# EAGLE design statuum (EAGLE 7.7.0)
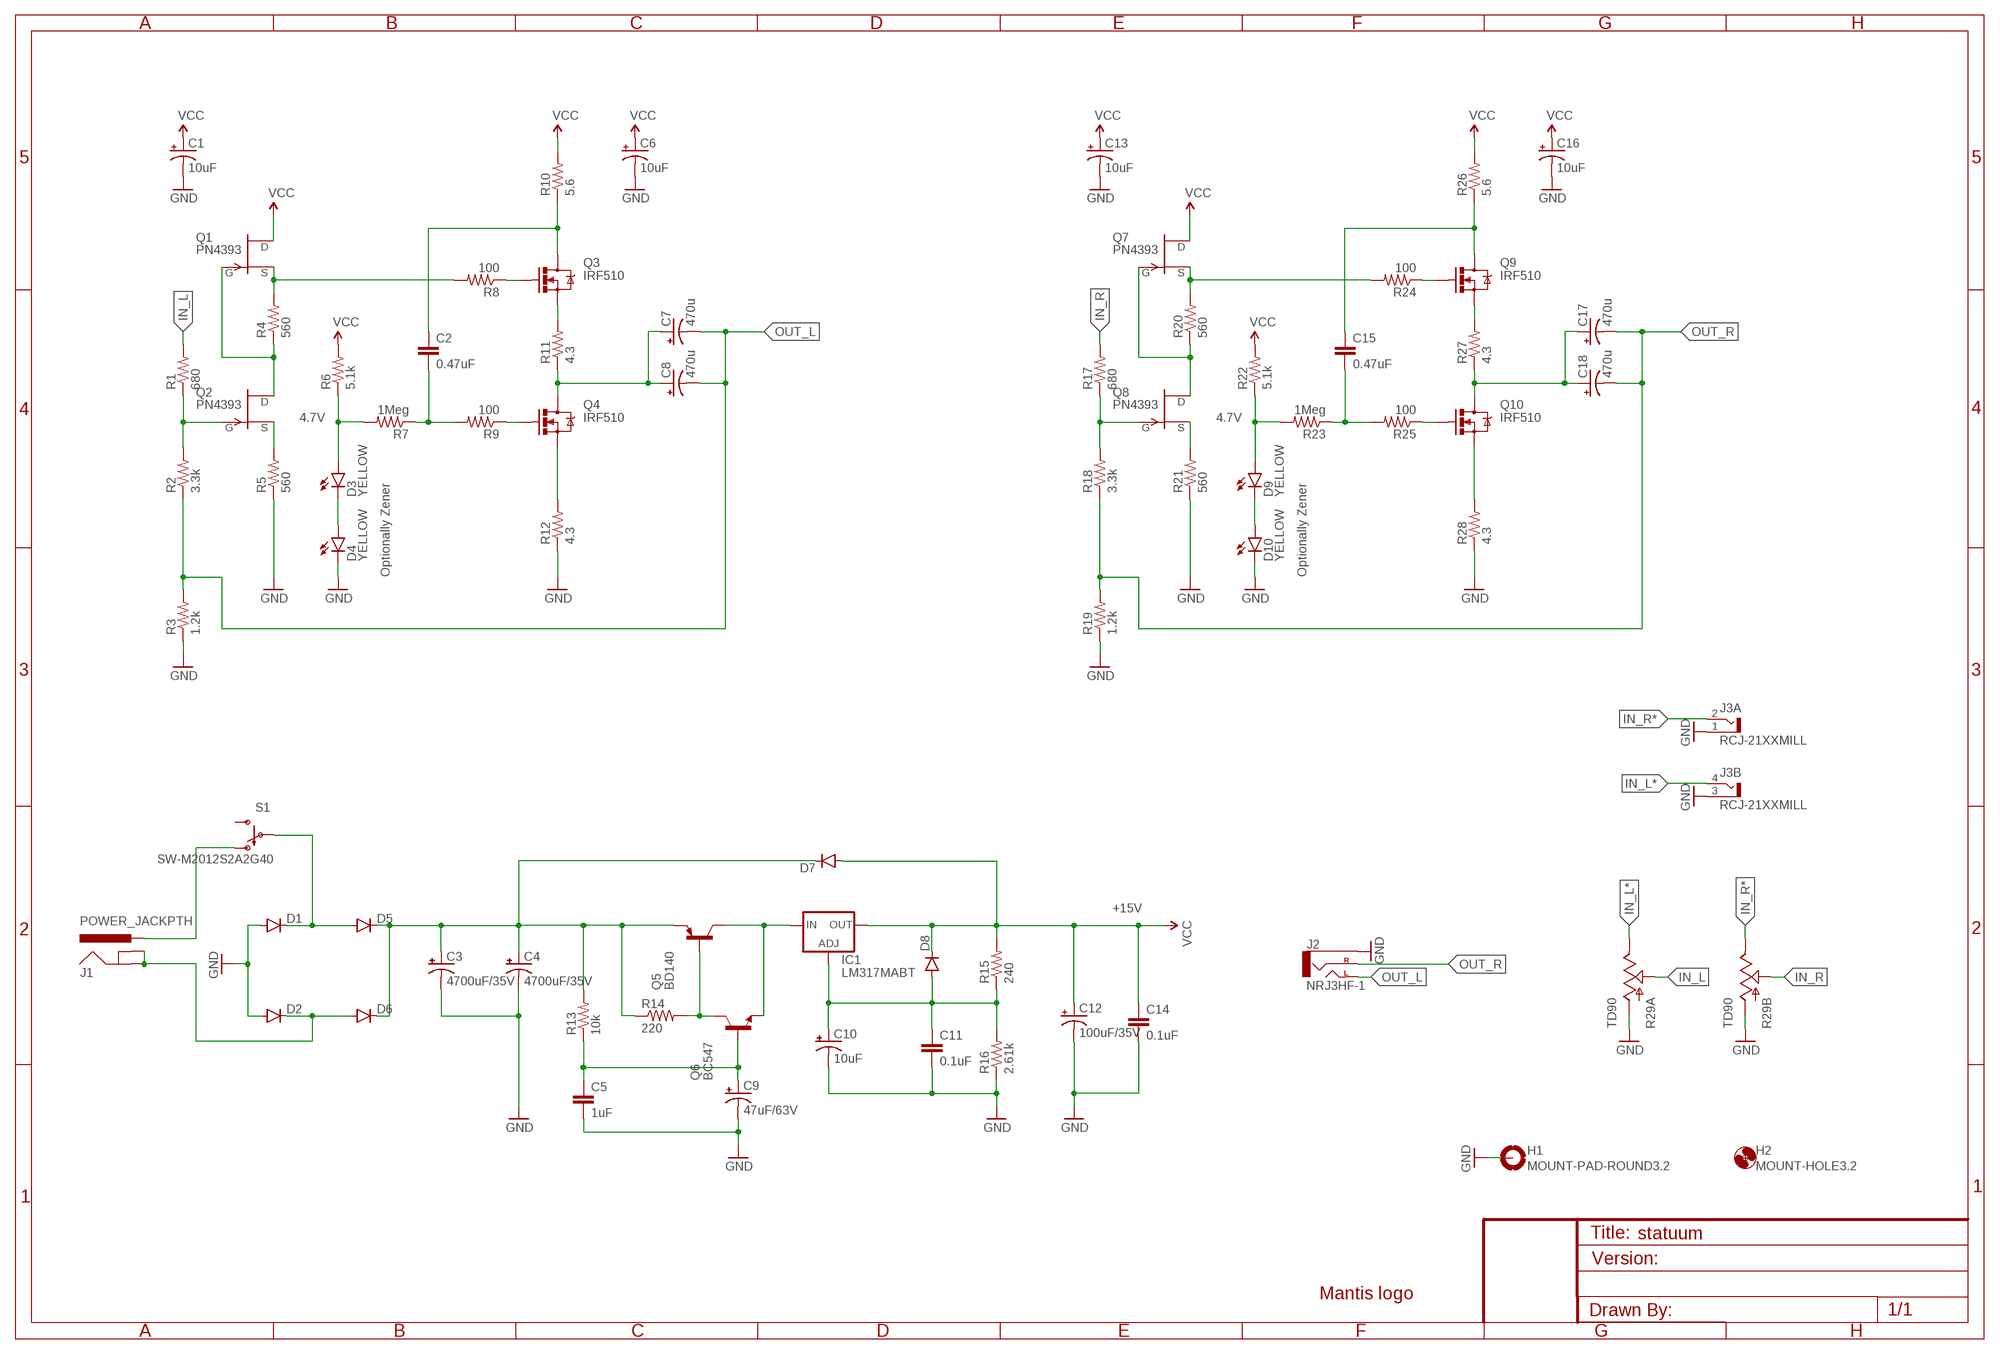
[diagram p0: schematic, sheet 1]

## Parts
C1  10uF  CAP_POLPTH-5/2.5-SM  [CPOL-RADIAL-5/2.5-SM]
C2  0.47uF  C5/3.5  [C5B3.5]
C3  4700uF/35V  CAP_POLPTH-16/7.5  [CPOL-RADIAL-16/7.5]
C4  4700uF/35V  CAP_POLPTH-16/7.5  [CPOL-RADIAL-16/7.5]
C5  1uF  CAPPTH  [CAP-PTH-SMALL]
C6  10uF  CAP_POLPTH-5/2.5-SM  [CPOL-RADIAL-5/2.5-SM]
C7  470u  CAP_POLPTH-8/3.5  [CPOL-RADIAL-8/3.5]
C8  470u  CAP_POLPTH-8/3.5  [CPOL-RADIAL-8/3.5]
C9  47uF/63V  CAP_POLPTH-6.5/2.5  [CPOL-RADIAL-6.5/2.5]
C10  10uF  CAP_POLPTH-5/2.5-SM  [CPOL-RADIAL-5/2.5-SM]
C11  0.1uF  CAPPTH  [CAP-PTH-SMALL]
C12  100uF/35V  CAP_POLPTH-8/3.5  [CPOL-RADIAL-8/3.5]
C13  10uF  CAP_POLPTH-5/2.5-SM  [CPOL-RADIAL-5/2.5-SM]
C14  0.1uF  CAPPTH  [CAP-PTH-SMALL]
C15  0.47uF  C5/3.5  [C5B3.5]
C16  10uF  CAP_POLPTH-5/2.5-SM  [CPOL-RADIAL-5/2.5-SM]
C17  470u  CAP_POLPTH-8/3.5  [CPOL-RADIAL-8/3.5]
C18  470u  CAP_POLPTH-8/3.5  [CPOL-RADIAL-8/3.5]
D1  DIODEPTH  [DIODE-1N4001]
D2  DIODEPTH  [DIODE-1N4001]
D3  YELLOW  LED3MM-SM  [LED3MM-SM]
D4  YELLOW  LED3MM-SM  [LED3MM-SM]
D5  DIODEPTH  [DIODE-1N4001]
D6  DIODEPTH  [DIODE-1N4001]
D7  DIODEPTH  [DIODE-1N4001]
D8  DIODEPTH  [DIODE-1N4001]
D9  YELLOW  LED3MM-SM  [LED3MM-SM]
D10  YELLOW  LED3MM-SM  [LED3MM-SM]
H1  MOUNT-PAD-ROUND3.2  [3,2-PAD]
H2  MOUNT-HOLE3.2  [3,2]
IC1  LM317MABT  [TO220L1]
J1  POWER_JACKPTH  [POWER_JACK_PTH]
J2  NRJ3HF-1  [NRJ3HF]
J3  RCJ-21XXMILL  [RCJ-21-MILL]
LOGO1  LOGO-MANTIS  [LOGO-MANTIS]
Q1  PN4393  [TO-92]
Q2  PN4393  [TO-92]
Q3  IRF510  [TO220-HORIZ]
Q4  IRF510  [TO220-HORIZ]
Q5  BD140  [TO126]
Q6  BC547  [TO-92]
Q7  PN4393  [TO-92]
Q8  PN4393  [TO-92]
Q9  IRF510  [TO220-HORIZ]
Q10  IRF510  [TO220-HORIZ]
R1  680  RESISTORPTH-1/4W  [AXIAL-0.4]
R2  3.3k  RESISTORPTH-1/4W  [AXIAL-0.4]
R3  1.2k  RESISTORPTH-1/4W  [AXIAL-0.4]
R4  560  RESISTORPTH-1/4W  [AXIAL-0.4]
R5  560  RESISTORPTH-1/4W  [AXIAL-0.4]
R6  5.1k  RESISTORPTH-1/4W  [AXIAL-0.4]
R7  1Meg  RESISTORPTH-1/4W  [AXIAL-0.4]
R8  100  RESISTORPTH-1/4W  [AXIAL-0.4]
R9  100  RESISTORPTH-1/4W  [AXIAL-0.4]
R10  5.6  RESISTORPTH-1/4W  [AXIAL-0.4]
R11  4.3  RESISTORPTH-1/4W  [AXIAL-0.4]
R12  4.3  RESISTORPTH-1/4W  [AXIAL-0.4]
R13  10k  RESISTORPTH-1/4W  [AXIAL-0.4]
R14  220  RESISTORPTH-1/4W  [AXIAL-0.4]
R15  240  RESISTORPTH-1/4W  [AXIAL-0.4]
R16  2.61k  RESISTORPTH-1/4W  [AXIAL-0.4]
R17  680  RESISTORPTH-1/4W  [AXIAL-0.4]
R18  3.3k  RESISTORPTH-1/4W  [AXIAL-0.4]
R19  1.2k  RESISTORPTH-1/4W  [AXIAL-0.4]
R20  560  RESISTORPTH-1/4W  [AXIAL-0.4]
R21  560  RESISTORPTH-1/4W  [AXIAL-0.4]
R22  5.1k  RESISTORPTH-1/4W  [AXIAL-0.4]
R23  1Meg  RESISTORPTH-1/4W  [AXIAL-0.4]
R24  100  RESISTORPTH-1/4W  [AXIAL-0.4]
R25  100  RESISTORPTH-1/4W  [AXIAL-0.4]
R26  5.6  RESISTORPTH-1/4W  [AXIAL-0.4]
R27  4.3  RESISTORPTH-1/4W  [AXIAL-0.4]
R28  4.3  RESISTORPTH-1/4W  [AXIAL-0.4]
R29  TD90  [PTD902]
S1  SW-M2012S2A2G40  [SW-M2012S2A2G40]

## Nets
GND: C1.2(-) C3.2(-) C4.2(-) C5.2 C6.2(-) C9.2(-) C10.2(-) C11.2 C12.2(-) C13.2(-) C14.2 C16.2(-) D1.A D2.A D4.K(C) D10.K(C) H1.B3,2(MOUNT) J2.S(SLEEVE) J3.1(A:S) J3.3(B:S) R3.P$1 R5.P$1 R12.P$1 R16.P$1 R19.P$1 R21.P$1 R28.P$1 R29.R1.1(A:A) R29.R2.1(B:A)
IN_L: R1.P$2 R29.R1.2(A:S)
IN_L*: J3.4(B:T) R29.R1.3(A:E)
IN_R: R17.P$2 R29.R2.2(B:S)
IN_R*: J3.2(A:T) R29.R2.3(B:E)
N$1: Q1.2(S) R4.P$2 R8.P$2
N$2: Q1.3(G) Q2.1(D) R4.P$1
N$3: Q2.2(S) R5.P$2
N$4: D3.K(C) D4.A
N$5: Q3.1(G) R8.P$1
N$6: Q2.3(G) R1.P$1 R2.P$2
N$7 [out]: Q3.3(S) R11.P$2
N$8: Q4.1(G) R9.P$1
N$9 [out]: Q9.3(S) R27.P$2
N$10 [out]: Q4.3(S) R12.P$2
N$11 [out]: C2.1 Q3.2(D) R10.P$1
N$12 [out]: C7.1(+) C8.1(+) Q4.2(D) R11.P$1
N$13: D1.C D5.A S1.S(P)
N$14: D3.A R6.P$1 R7.P$2
N$15: C2.2 R7.P$1 R9.P$2
N$16: Q7.2(S) R20.P$2 R24.P$2
N$17: Q7.3(G) Q8.1(D) R20.P$1
N$18: Q8.2(S) R21.P$2
N$19: Q8.3(G) R17.P$1 R18.P$2
N$20: Q9.1(G) R24.P$1
N$21: Q10.1(G) R25.P$1
N$22 [out]: Q10.3(S) R28.P$2
N$23 [out]: C15.1 Q9.2(D) R26.P$1
N$24: D9.A R22.P$1 R23.P$2
N$25: D9.K(C) D10.A
N$26: Q5.3(B) Q6.1(C) R14.P$2
N$27: C5.1 C9.1(+) Q6.2(B) R13.P$1
N$28: C15.2 R23.P$1 R25.P$2
N$29 [out]: C17.1(+) C18.1(+) Q10.2(D) R27.P$1
N$30: D2.C D6.A J1.GND J1.GNDBREAK
N$32: C10.1(+) C11.1 D8.A IC1.1(ADJ) R15.P$1 R16.P$2
N$34 [pwr]: C3.1(+) C4.1(+) D5.C D6.C D7.C Q5.1(E) R13.P$2 R14.P$1
N$35: J1.PWR S1.UP-CONNECT(O)
N$36 [pwr]: IC1.3(IN) Q5.2(C) Q6.3(E)
OUT_L [out]: C7.2(-) C8.2(-) J2.T(LEFT) R2.P$1 R3.P$2
OUT_R [out]: C17.2(-) C18.2(-) J2.R(RIGHT) R18.P$1 R19.P$2
VCC [pwr]: C1.1(+) C6.1(+) C12.1(+) C13.1(+) C14.1 C16.1(+) D7.A D8.C IC1.2(OUT) Q1.1(D) Q7.1(D) R6.P$2 R10.P$2 R15.P$2 R22.P$2 R26.P$2
Unconnected: S1.DN-CONNECT(S)

## Notes on the sheet
- 4.7V | 4.7V
- Optionally Zener | Optionally Zener
- +15V

## Library data of the parts
C1 C3 C4 C6-C10 C12 C13 C16-C18 = my-cap:CAP_POL: Capacitor Polarized These are standard SMD and PTH capacitors. Normally 10uF, 47uF, and 100uF in electrolytic and tantalum varieties. Always verify the external diameter of the through hole cap, it varies with capacity, voltage, and manufacturer. The EIA devices should be standard.
C2 C15 = capacitor-wima:C: CAPACITOR naming: grid - package width
C5 C11 C14 = SparkFun-Capacitors:CAP: Capacitor Standard 0603 ceramic capacitor, and 0.1" leaded capacitor.
D1 D2 D5-D8 = SparkFun-DiscreteSemi:DIODE: Diode These are standard reverse protection diodes and small signal diodes. SMA package can handle up to about 1A. SOD-323 can handle about 200mA. What the SOD-323 package when ordering, there are some mfgs out there that are 5-pin packages.
D3 D4 D9 D10 = my:LED: LEDs Standard schematic elements and footprints for 5mm, 3mm, 1206, and 0603 sized LEDs. 5mm - Spark Fun Electronics SKU : COM-00529 (and others)
H1 = holes:MOUNT-PAD-ROUND: MOUNTING PAD, round
H2 = holes:MOUNT-HOLE: MOUNTING HOLE with drill center marker
IC1 = v-reg:LM317?*: 500 mA Adjustable Output Positive Voltage Regulator Source: http://www.onsemi.co.jp .. LM317M-D.PDF
J1 = SparkFun-Connectors:POWER_JACK: Power Jack This is the standard 5.5mm barrel jack for power. The PTH is the most common, proven, reliable, footprint. The Slot footprint only works if the mill layer is transmitted to the PCB fab house so be warned. Mating wall wart : TOL-00298 (and others); PROD_ID: CONN-08197
J2 = my-conn:NRJ3HF-1: 1/4" Phone Jack
J3 = my:RCJ-21XX: Dual RCA Jack
LOGO1 = my:LOGO-MANTIS: Mantis logo
Q1 Q2 Q7 Q8 = my-tran:PN4393
Q3 Q4 Q9 Q10 = my-tran:IRF510
Q5 = transistor-pnp:BD140: PNP Transistor
Q6 = my-tran:BC547: NPN Epitaxial Silicon Transistor
R1-R28 = my-res:RESISTOR: Resistor Basic schematic elements and footprints for 0603, 1206, and PTH resistors.
R29 = my:TD90: PTD90 Series - 9 mm Multi-Ganged Potentiometer
S1 = my-conn:SW-M2012S2A2G40

## Net classes
1 pwr: width 1.27 mm
2 out: width 0.813 mm

## Board
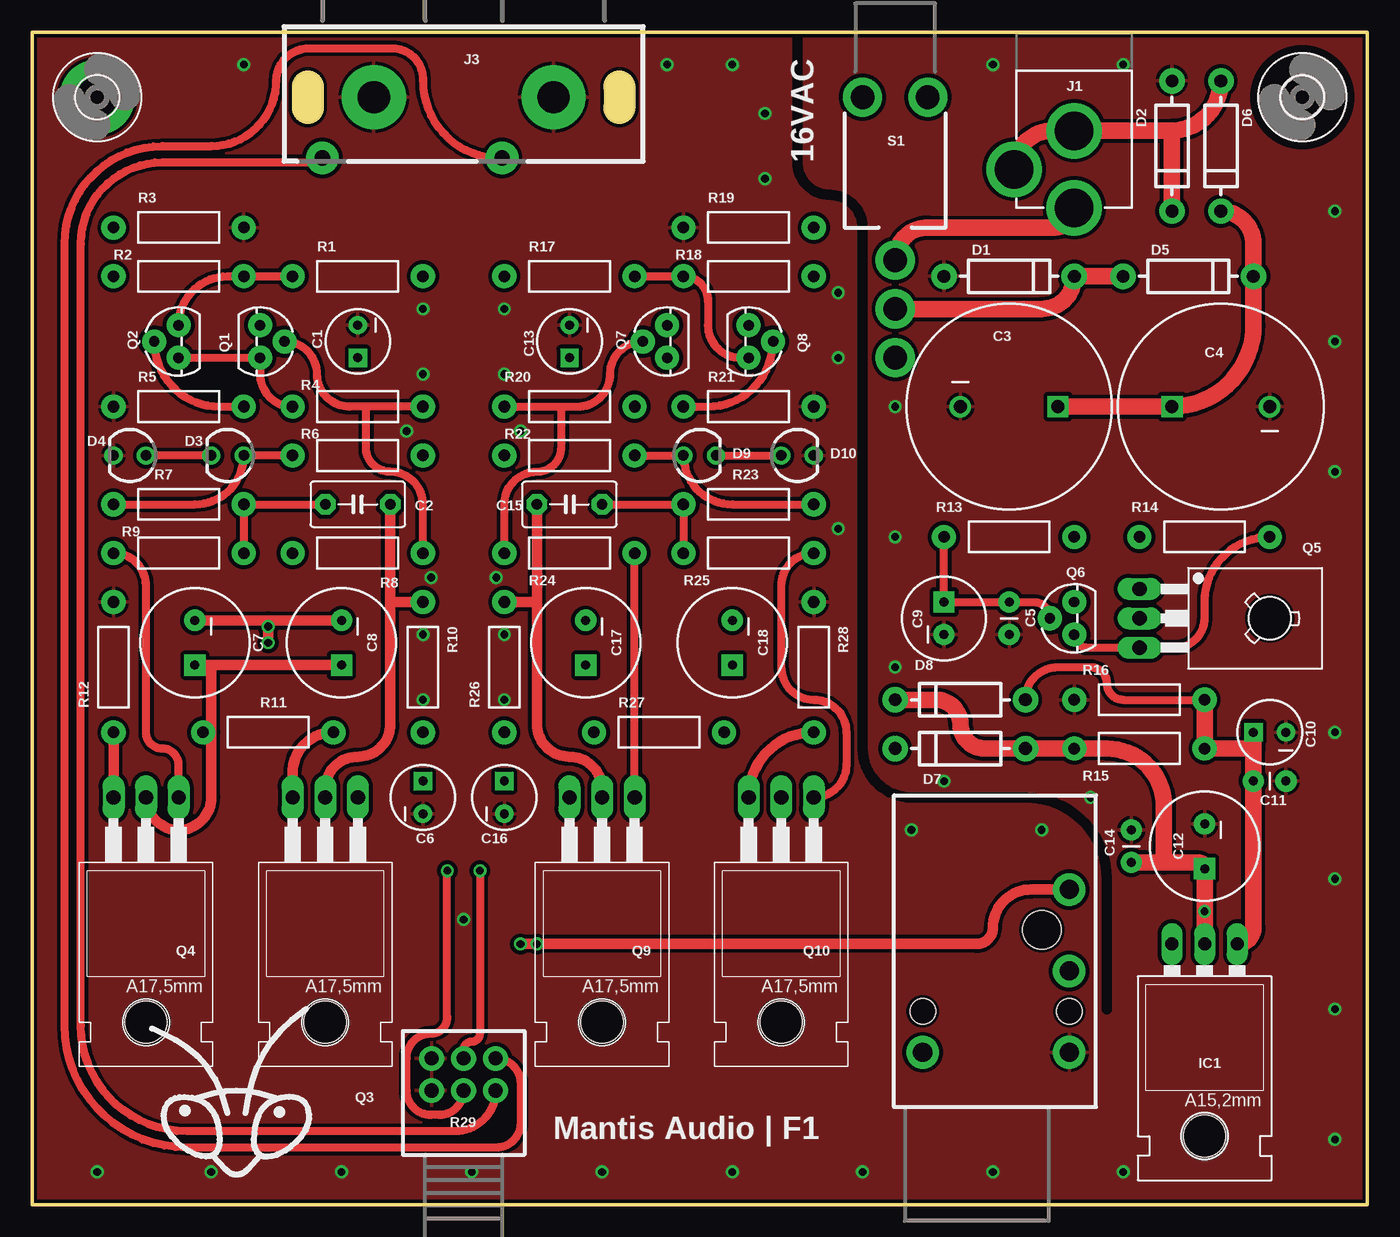
[diagram p1: board, top side]
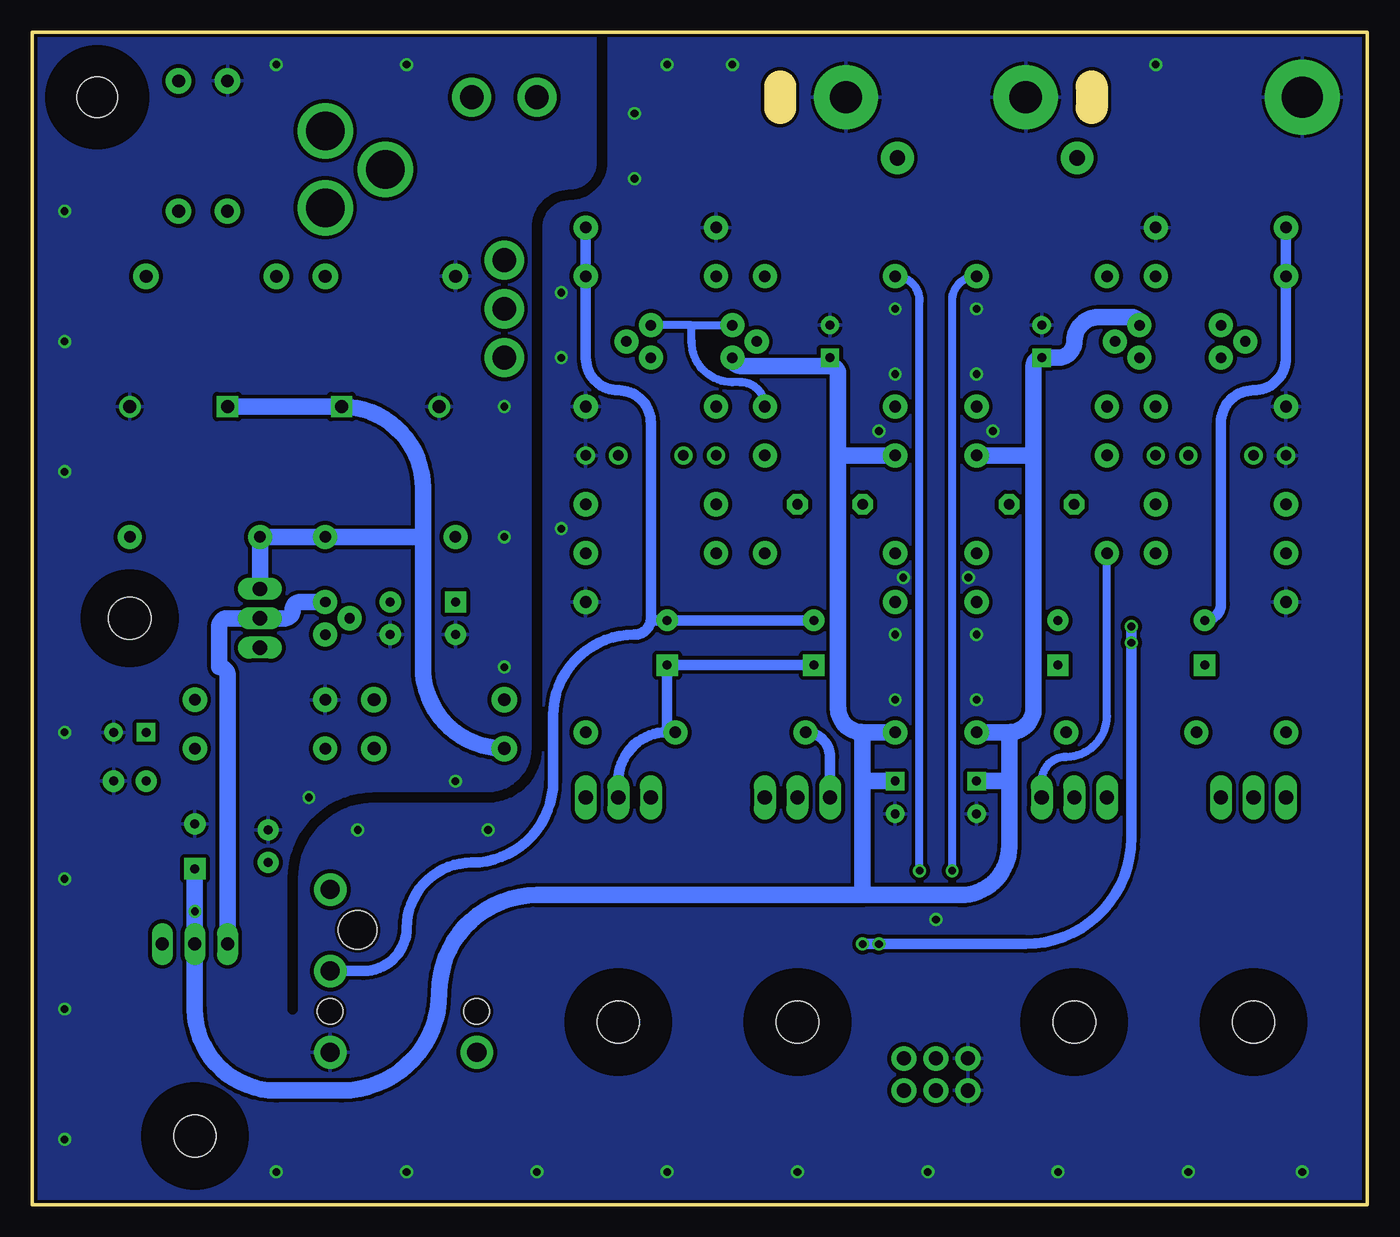
[diagram p2: board, bottom side, seen from below]

Size 104.14 x 91.44 mm. Coordinates in mm from the lower left corner, seen from the top.
Outline: 0,0 0,91.44 104.14,91.44 104.14,0 0,0
Copper layers (1*16): Top 0.035mm / dielectric 1.5mm / Bottom 0.035mm
Design rules "SeeedStudio_2layer_DRU_no_angle_20140221 *": minimum track width 12mil, minimum drill 12mil, track to track 12mil, track to pad 12mil, pad to pad 12mil, via to via 12mil, smd to smd 0mil, copper to edge 10mil, drill to drill 12mil, minimum pad ring 12mil, minimum via ring 8mil, stop-mask expansion 2mil, vias tented up to drill 100mil, thermal gap 10mil
tRestrict: 8 lines
bRestrict: 8 lines

### Footprints (pad centres in the part's own frame; a part is rotated, then mirrored left to right if it is on the bottom)
CPOL-RADIAL-5/2.5-SM = drill 0.7 pad 1.422 square: 1 1.27,0 | drill 0.7 pad 1.422: 2 -1.27,0
C5B3.5 = drill 0.813 pad 1.6 octagon: 1 -2.54,0; 2 2.54,0
CPOL-RADIAL-16/7.5 = drill 1.016 pad 1.651 square: 1 3.81,0 | drill 1.016 pad 1.676: 2 -3.81,0
CAP-PTH-SMALL = drill 0.7 pad 1.651: 1 0,0; 2 2.54,0
CPOL-RADIAL-8/3.5 = drill 0.7 pad 1.651 square: 1 1.75,0 | drill 0.7 pad 1.651: 2 -1.75,0
CPOL-RADIAL-6.5/2.5 = drill 0.7 pad 1.651 square: 1 1.27,0 | drill 0.7 pad 1.651: 2 -1.27,0
DIODE-1N4001 = drill 1 pad 1.981: A -5.08,0; C 5.08,0
LED3MM-SM = drill 0.813 pad 1.422: A -1.27,0; K 1.27,0
3,2-PAD = drill 3.2 pad 5.842: B3,2 0,0
3,2 = hole 3.2: 0,0
TO220L1 = drill 1.016 long: 1 -2.54,-3.81; 2 0,-3.81; 3 2.54,-3.81 | hole 3.302: 0,11.176
POWER_JACK_PTH = drill 2.997 pad 4.318: GND 0,7.7; GNDBREAK 4.7,10.7; PWR 0,13.7
NRJ3HF = drill 1.5 pad 2.54: G -4.25,-4.2; R -10.6,7.23; S -4.25,7.23; T -16.95,7.23 | hole 2: -7.45,7.23; -7.45,-4.2 | hole 3: -13.8,5.1
RCJ-21-MILL = drill 2.5 pad 5: 1 7,0; 3 -7,0 | drill 1.2 pad 2.54: 2 3,-4.75; 4 -11,-4.75
TO-92 = drill 0.813 pad 1.88: 1 -1.27,0; 2 0,1.905; 3 1.27,0
TO220-HORIZ = drill 1.118 long: 1 -2.54,-6.35; 2 0,-6.35; 3 2.54,-6.35 | hole 3.302: 0,11.176
TO126 = drill 1.118 long: 1 -2.286,-5.08; 2 0,-5.08; 3 2.286,-5.08 | hole 3.302: 0,5.08
AXIAL-0.4 = drill 0.9 pad 1.88: P$1 -5.08,0; P$2 5.08,0
PTD902 = drill 1.1 pad 1.93: R1.1 0,-2.5; R1.2 0,0; R1.3 0,2.5; R2.1 -2.5,-2.5; R2.2 -2.5,0; R2.3 -2.5,2.5
SW-M2012S2A2G40 = drill 1.854 pad 3.048: DN-CONNECT 0,20.32; G1 -2.54,0; G2 2.54,0; S 0,16.51; UP-CONNECT 0,12.7

### Placement (x,y rotation side)
C1  25.4,67.31 270 top
C2  25.4,54.61 180 top
C3  76.2,62.23 0 top
C4  92.71,62.23 180 top
C5  76.2,46.99 270 top
C6  30.48,31.75 90 top
C7  12.7,43.81 270 top
C8  24.13,43.81 270 top
C9  71.12,45.72 90 top
C10  96.52,36.83 180 top
C11  95.25,33.02 0 top
C12  91.44,27.94 270 top
C13  41.91,67.31 270 top
C14  85.72,26.67 90 top
C15  41.91,54.61 0 top
C16  36.83,31.75 90 top
C17  43.18,43.81 270 top
C18  54.61,43.81 270 top
D1  76.2,72.39 0 top
D2  88.9,82.55 270 top
D3  15.24,58.42 180 top
D4  7.62,58.42 180 top
D5  90.17,72.39 0 top
D6  92.71,82.55 270 top
D7  72.39,35.56 180 top
D8  72.39,39.37 180 top
D9  52.07,58.42 0 top
D10  59.69,58.42 0 top
H1  5.08,86.36 0 top
H2  99.06,86.36 0 top
IC1  91.44,16.51 180 top
J1  81.28,91.44 180 top
J2  73.66,7.62 270 top
J3  33.66,86.36 0 top
LOGO1  15.88,8.89 0 top
Q1  17.78,67.31 270 top
Q2  11.43,67.31 90 top
Q3  22.86,25.4 180 top
Q4  8.89,25.4 180 top
Q5  91.44,45.72 270 top
Q6  81.28,45.72 90 top
Q7  49.53,67.31 90 top
Q8  55.88,67.31 270 top
Q9  44.45,25.4 180 top
Q10  58.42,25.4 180 top
R1  25.4,72.39 0 top
R2  11.43,72.39 0 top
R3  11.43,76.2 180 top
R4  25.4,62.23 0 top
R5  11.43,62.23 0 top
R6  25.4,58.42 0 top
R7  11.43,54.61 180 top
R8  25.4,50.8 0 top
R9  11.43,50.8 0 top
R10  30.48,41.91 270 top
R11  18.41,36.83 0 top
R12  6.35,41.91 270 top
R13  76.2,52.07 0 top
R14  91.44,52.07 0 top
R15  86.36,35.56 180 top
R16  86.36,39.37 0 top
R17  41.91,72.39 180 top
R18  55.88,72.39 180 top
R19  55.88,76.2 0 top
R20  41.91,62.23 180 top
R21  55.88,62.23 180 top
R22  41.91,58.42 180 top
R23  55.88,54.61 0 top
R24  41.91,50.8 180 top
R25  55.88,50.8 180 top
R26  36.83,41.91 270 top
R27  48.9,36.83 180 top
R28  60.96,41.91 270 top
R29  33.66,8.89 270 top
S1  67.31,86.36 180 top

### Tracks (layer width: path | path; a pad name or v marks a point on that pad's centre or on a via)
GND  (via drill 0.6)
  other vias: 16.51,88.9 49.53,88.9 54.61,88.9 57.15,85.09 57.15,80.01 13.97,2.54 24.13,2.54 34.29,2.54 44.45,2.54 54.61,2.54 64.77,2.54 74.93,2.54 85.09,2.54 101.6,5.08 101.6,15.24 101.6,25.4 101.6,36.83 101.6,57.15 101.6,67.31 101.6,77.47 85.09,88.9 74.93,88.9 62.87,71.12 62.87,66.04 62.87,52.7 67.31,62.23 67.31,52.07 67.31,41.91 71.12,33.02 82.55,31.75 68.58,29.21 78.74,29.21 33.66,22.23 36.83,44.45 36.83,39.37 30.48,44.45 30.48,39.37 5.08,2.54 30.48,64.77 36.83,64.77 36.83,69.85 30.48,69.85 29.21,60.33 38.1,60.33 36.2,48.9 31.11,48.9
  pour Top: 0,91.44 0,0 104.14,0 104.14,91.44
  pour Bottom: 0,91.44 104.14,91.44 104.14,0 0,0
IN_L  (via drill 0.6)
  Top 0.61: R29.R1.2 arc-90 31.75,6.99 31.11,6.99 arc-90 29.21,8.89 29.21,11.43 arc-90 31.11,13.34 arc90 32.38,14.61 v32.38,26.04
  Bottom 0.61: v32.38,26.04 32.38,70.48 arc90 R1.P$2
IN_L*
  Top 0.61: R29.R1.3 arc-90 32.98,5.71 12.06,5.71 arc-90 3.81,13.97 3.81,74.93 arc-90 10.16,81.28 22.32,81.28 arc90 J3.4
IN_R  (via drill 0.6)
  Top 0.61: v34.92,26.04 34.92,13.34 arc-90 34.29,12.7 arc90 33.66,12.06 R29.R2.2
  Bottom 0.61: v34.92,26.04 34.92,70.48 arc-90 R17.P$2
IN_R*
  Top 0.61: R29.R2.3 arc-90 38.1,9.45 38.1,6.35 arc-90 36.2,4.45 12.06,4.45 arc-90 2.54,13.97 2.54,74.93 arc-90 10.16,82.55 13.97,82.55 arc90 19.05,87.63 arc-90 21.59,90.17 28.09,90.17 arc-90 30.48,87.78 30.48,87.63 arc90 36.5,81.61 J3.2
N$1
  Top 0.61: R4.P$2 26.04,62.23 | 26.04,62.23 24.77,62.23 arc-90 22.23,64.77 arc90 Q1.2 | R8.P$2 30.48,54.61 arc90 27.94,57.15 arc-90 26.04,59.05 26.04,62.23
N$2
  Top 0.61: Q2.1 Q1.3 17.78,64.77 arc90 R4.P$1
N$3
  Top 0.61: Q2.2 arc90 14.61,62.23 R5.P$2
N$4
  Top 0.61: D3.K D4.A
N$5
  Bottom 0.61: Q3.1 25.4,33.02 arc90 23.5,34.92 arc-90 20.32,38.1 R8.P$1
N$6
  Top 0.61: Q2.3 arc-90 15.24,72.39 R2.P$2 R1.P$1
N$7
  Top 0.813: Q3.3 20.32,33.66 arc-90 R11.P$2
N$8
  Top 0.61: Q4.1 11.43,34.29 arc90 10.16,35.56 arc-90 8.89,36.83 8.89,48.26 arc90 R9.P$1
N$9
  Bottom 0.813: Q9.3 41.91,34.92 arc-90 R27.P$2
N$10
  Top 0.813: Q4.3 R12.P$2
N$11
  Top 0.813: Q3.2 22.86,32.38 arc-90 25.4,34.92 arc90 27.94,37.47 27.94,46.99 | 27.94,46.99 C2.1 | R10.P$1 27.94,46.99
N$12
  Top 0.813: C7.1 13.97,42.06 | 13.97,42.06 C8.1 | Q4.2 arc90 11.43,29.21 arc90 13.97,31.75 13.97,36.83 | 13.97,36.83 13.97,42.06 | R11.P$1 13.97,36.83
N$13
  Top 1.27: D5.A D1.C arc-90 78.74,69.85 S1.S
N$14
  Top 0.61: R6.P$1 D3.A arc-90 12.7,54.61 R7.P$2
N$15
  Top 0.61: R9.P$2 R7.P$1 C2.2
N$16
  Top 0.61: R20.P$2 41.27,62.23 | 41.27,62.23 42.55,62.23 arc90 45.09,64.77 arc-90 Q7.2 | R24.P$2 36.83,54.61 arc-90 39.37,57.15 arc90 41.27,59.05 41.27,62.23
N$17
  Bottom 0.61: R20.P$1 arc-90 48.9,64.14 49.53,64.14 arc90 52.7,67.31 52.7,68.58 | 52.7,68.58 Q8.1 | 52.7,68.58 Q7.3
N$18
  Top 0.61: R21.P$2 52.7,62.23 arc90 Q8.2
N$19
  Top 0.61: R17.P$1 R18.P$2 arc-90 52.7,70.48 52.7,68.58 arc90 55.24,66.04 Q8.3
N$20
  Top 0.61: Q9.1 R24.P$1
N$21
  Top 0.61: R25.P$1 arc90 58.42,48.26 58.42,41.91 arc90 60.96,39.37 arc-90 63.5,36.83 63.5,34.29 arc-90 Q10.1
N$22
  Top 0.813: Q10.3 arc-90 R28.P$2
N$23
  Top 0.813: Q9.2 44.45,32.38 arc90 41.91,34.92 arc-90 39.37,37.47 39.37,46.99 | 39.37,46.99 C15.1 | R26.P$1 39.37,46.99
N$24
  Top 0.61: R22.P$1 D9.A arc90 54.61,54.61 R23.P$2
N$25
  Top 0.61: D9.K D10.A
N$26
  Top 0.61: Q6.1 arc90 82.3,43.43 Q5.3 89.15,43.43 arc90 91.44,45.72 91.44,46.99 arc-90 R14.P$2
N$27
  Top 0.61: R13.P$1 C9.1 C5.1 78.11,46.99 arc-90 Q6.2
N$28
  Top 0.61: C15.2 R23.P$1 R25.P$2
N$29
  Bottom 0.813: C17.1 C18.1 54.61,36.83 | Q10.2 58.42,33.02 arc90 54.61,36.83 | 54.61,36.83 R27.P$1
N$30
  Top 1.27: J1.GNDBREAK arc-90 79.58,83.74 J1.GND 88.82,83.74 | 88.82,83.74 arc90 D6.A | D2.C 88.9,83.66 arc90 88.82,83.74
N$32
  Top 0.61: D8.A arc-90 80.01,41.91 82.55,41.91 arc-90 83.82,40.64 arc90 85.09,39.37 R16.P$2
  Top 1.27: R16.P$2 R15.P$1 95.25,35.56 | 95.25,35.56 C11.1 95.25,21.59 arc-90 IC1.1 | 95.25,35.56 C10.1
N$34
  Top 1.27: D6.C arc-90 95.25,74.93 D5.C 95.25,68.58 arc-90 C4.1 C3.1
  Bottom 1.27: C4.1 C3.1 arc90 73.66,55.88 73.66,52.07 | D7.C arc90 73.66,41.91 73.66,52.07 | Q5.1 R14.P$1 R13.P$2 73.66,52.07
N$35
  Top 1.27: S1.UP-CONNECT arc-90 69.85,76.2 79.74,76.2 arc90 J1.PWR
N$36
  Bottom 1.27: IC1.3 88.9,41.27 arc-90 89.53,41.91 89.53,45.09 arc90 88.9,45.72 Q5.2 84.45,45.72 arc-90 83.82,46.35 arc90 83.19,46.99 Q6.3
OUT_L  (via drill 0.6)
  Top 0.813: C7.2 18.41,45.56 | 18.41,45.56 C8.2 | 18.41,45.56 v18.41,45.09 v18.41,43.81 | J2.T 77.91,24.57 arc90 74.93,21.59 arc-90 73.66,20.32 v39.37,20.32 v38.1,20.32
  Bottom 0.813: R3.P$2 R2.P$1 6.35,66.04 arc90 8.89,63.5 arc-90 11.43,60.96 11.43,46.84 arc90 C7.2 | v18.41,45.09 v18.41,43.81 18.41,28.57 arc90 26.67,20.32 v38.1,20.32 v39.37,20.32
OUT_R
  Bottom 0.813: R19.P$2 R18.P$1 60.96,66.04 arc-90 58.42,63.5 arc90 55.88,60.96 55.88,45.72 | C17.2 C18.2 55.88,45.56 55.88,45.72 | J2.R 78.3,18.22 arc-90 74.93,21.59 arc90 69.85,26.67 arc-90 63.5,33.02 63.5,38.1 arc90 57.15,44.45 arc-90 55.88,45.72
VCC  (via drill 0.6)
  Top 1.27: D8.C 70.48,39.37 arc-90 72.39,37.47 arc90 74.3,35.56 D7.A R15.P$2 83.82,35.56 arc-90 88.27,31.11 88.27,26.67 | IC1.2 v91.44,22.86 C12.1 arc90 90.96,26.67 88.27,26.67 | 88.27,26.67 C14.1
  Bottom 1.27: 41.91,65.41 C13.1 | Q1.1 arc-90 18.41,69.22 20.95,69.22 arc-90 22.86,67.31 arc90 24.13,66.04 C1.1 arc-90 26.04,65.41 26.04,58.42 | Q7.1 arc-90 48.9,65.41 41.91,65.41 | 26.04,58.42 26.04,38.73 arc90 27.94,36.83 | R10.P$2 27.94,36.83 | 27.94,36.83 27.94,33.02 | 27.94,33.02 27.94,27.94 arc90 31.75,24.13 39.37,24.13 | 41.91,65.41 arc90 41.27,64.77 41.27,58.42 | 41.27,58.42 41.27,38.73 arc-90 39.37,36.83 | 39.37,36.83 R26.P$2 | 39.37,36.83 39.37,33.02 | 39.37,33.02 39.37,24.13 | R6.P$2 26.04,58.42 | R22.P$2 41.27,58.42 | C6.1 27.94,33.02 | C16.1 39.37,33.02 | C12.1 v91.44,22.86 IC1.2 91.44,15.24 arc-90 85.09,8.89 80.01,8.89 arc-90 72.39,16.51 arc90 64.77,24.13 39.37,24.13

### Text on the board
tPlace: 16VAC | Mantis Audio | F1